# EAGLE schematic OM (EAGLE 9.6.0)
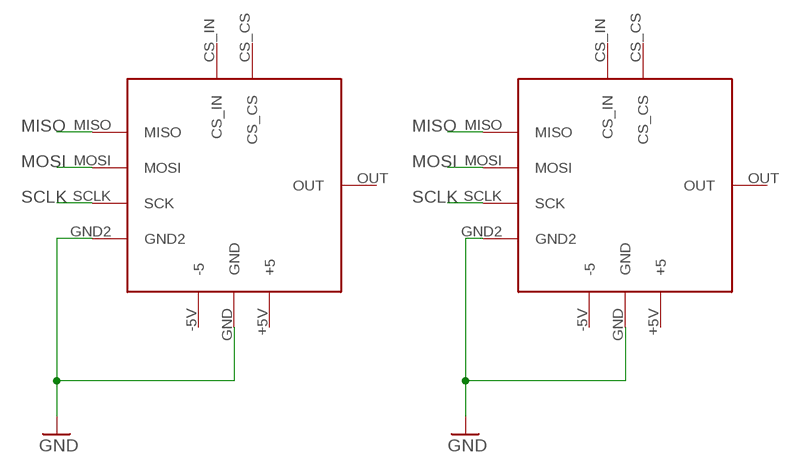
[diagram p0: schematic, sheet 1]

## Parts
U$1  NEURON_BOARD  [NEURON_BOARD]
U$2  NEURON_BOARD  [NEURON_BOARD]

## Nets
GND: U$1.GND U$1.GND2 U$2.GND U$2.GND2
MISO: U$1.MISO U$2.MISO
MOSI: U$1.MOSI U$2.MOSI
SCLK: U$1.SCLK(SCK) U$2.SCLK(SCK)
Unconnected: U$1.+5V(+5) U$1.-5V(-5) U$1.CS_CS U$1.CS_IN U$1.OUT U$2.+5V(+5) U$2.-5V(-5) U$2.CS_CS U$2.CS_IN U$2.OUT

## Library data of the parts
U$1 U$2 = titled:NEURON_BOARD